# EAGLE design rc_switch_dualsided (EAGLE 6.5.0)
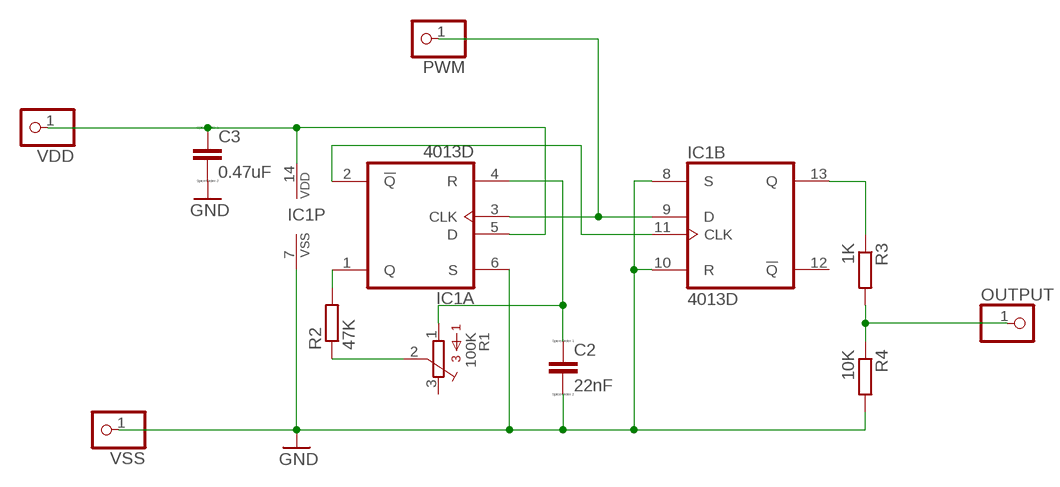
[diagram p0: schematic, sheet 1]

## Parts
C2  22nF  CC3216  [C3216]
C3  0.47uF  CC3216  [C3216]
IC1  4013D  [SO14]
OUTPUT  PINHD-1X1  [1X01]
PWM  PINHD-1X1  [1X01]
R1  100K  3386-P  [3386P]
R2  47K  R-EU_R3225  [R3225]
R3  1K  R-EU_R3225  [R3225]
R4  10K  R-EU_R3225  [R3225]
VDD  PINHD-1X1  [1X01]
VSS  PINHD-1X1  [1X01]

## Nets
GND: C2.2 C3.2 IC1.6(A:S) IC1.7(P:VSS) IC1.8(B:S) IC1.10(B:R) R4.2 VSS.1
N$1: IC1.1(A:Q) R2.2
N$2: R1.2 R2.1
N$3: C2.1 IC1.4(A:R) R1.1
N$4: IC1.13(B:Q) R3.1
N$6: IC1.3(A:CLK) IC1.9(B:D) PWM.1
N$8: IC1.2(A:!Q) IC1.11(B:CLK)
N$9: C3.1 IC1.5(A:D) IC1.14(P:VDD) VDD.1
OUTPUT: OUTPUT.1 R3.2 R4.1
Unconnected: IC1.12(B:!Q) R1.3

## Library data of the parts
C2 C3 = eagle-ltspice:C: CAPACITOR, European symbol; SPICEMODEL: NONE; SPICEPREFIX: C
IC1 = 40xx:4013: Dual D FLIP FLOP, set/reset
OUTPUT PWM VDD VSS = pinhead:PINHD-1X1: PIN HEADER
R1 = bourns:3386-: 3386 Series 3/8" Square Trimmer
R2-R4 = rcl:R-EU_: RESISTOR, European symbol

## Board
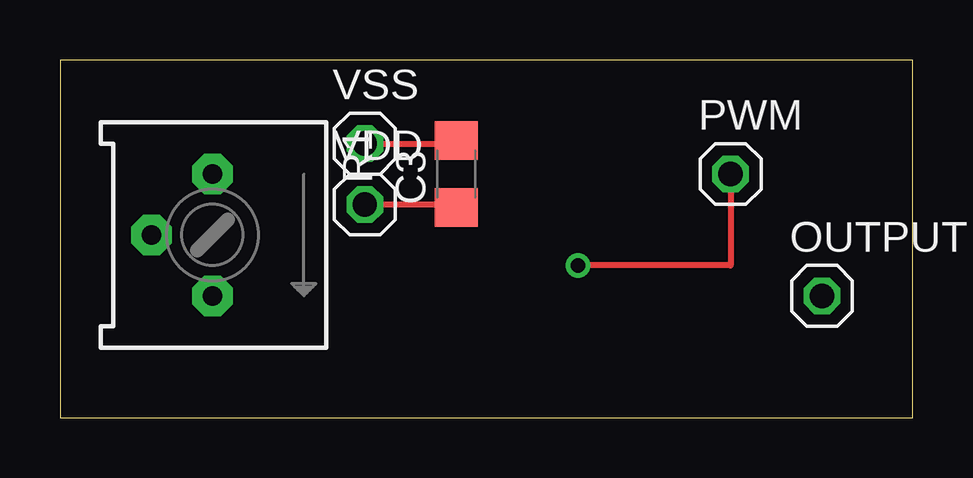
[diagram p1: board, top side]
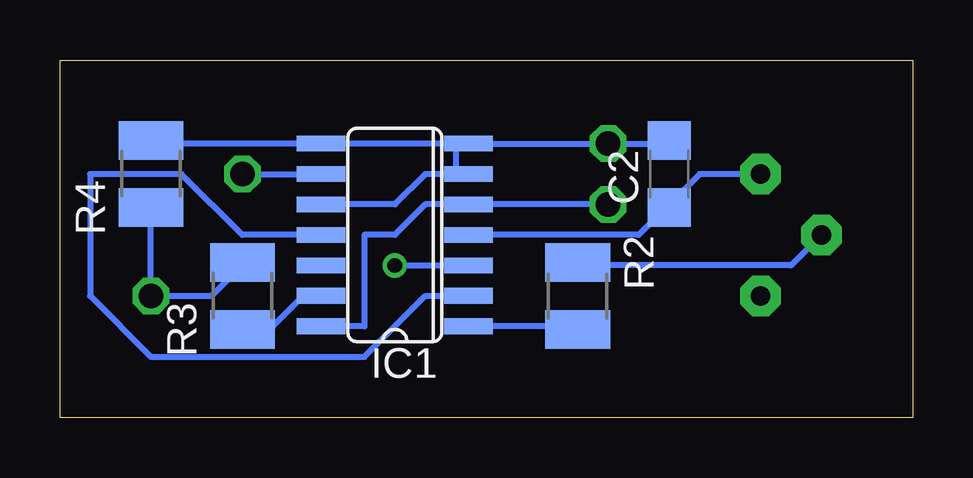
[diagram p2: board, bottom side, seen from below]

Size 35.54 x 14.91 mm. Coordinates in mm from the lower left corner, seen from the top.
Outline: 0,0 35.54,0 35.54,14.91 0,14.91 0,0
Copper layers (1*16): Top 0.035mm / dielectric 1.5mm / Bottom 0.035mm
Design rules "rcswitch": minimum track width 10mil, minimum drill 24mil, track to track 0.205mm, track to pad 0.205mm, pad to pad 0.205mm, via to via 0.205mm, smd to smd 8mil, copper to edge 40mil, drill to drill 8mil, minimum pad ring 10mil, minimum via ring 8mil, stop-mask expansion 4mil, vias tented up to drill 0mil, thermal gap 10mil

### Footprints (pad centres in the part's own frame; a part is rotated, then mirrored left to right if it is on the bottom)
C3216 = smd 1.6 x 1.8: 1 -1.4,0; 2 1.4,0
SO14 = smd 0.66 x 2.032: 1 -3.81,-3.073; 2 -2.54,-3.073; 3 -1.27,-3.073; 4 0,-3.073; 5 1.27,-3.073; 6 2.54,-3.073; 7 3.81,-3.073; 8 3.81,3.073; 9 2.54,3.073; 10 1.27,3.073; 11 0,3.073; 12 -1.27,3.073; 13 -2.54,3.073; 14 -3.81,3.073
1X01 = drill 1.016 octagon: 1 0,0
3386P = drill 0.813 pad 1.676 octagon: 1 -2.54,0; 2 0,-2.54; 3 2.54,0
R3225 = smd 1.6 x 2.7: 1 -1.4,0; 2 1.4,0

### Placement (x,y rotation side)
C2  10.16,10.16 90 bottom
C3  16.51,10.16 90 top
IC1  21.59,7.62 90 bottom
OUTPUT  31.75,5.08 0 top
PWM  27.94,10.16 0 top
R1  6.35,7.62 270 top
R2  13.97,5.08 270 bottom
R3  27.94,5.08 90 bottom
R4  31.75,10.16 90 bottom
VDD  12.7,8.89 0 top
VSS  12.7,11.43 0 top

### Tracks (layer width: path | path; a pad name or v marks a point on that pad's centre or on a via)
GND
  Top 0.254: VSS.1 16.51,11.43 C3.2
  Bottom 0.254: C2.2 10.16,11.43 VSS.1 IC1.7 19.05,11.43 | 19.05,11.43 19.05,10.16 | IC1.10 21.59,8.89 20.32,10.16 19.05,10.16 | 19.05,10.16 IC1.6 | 19.05,11.43 IC1.8 31.75,11.43 R4.2
N$1
  Bottom 0.254: IC1.1 13.97,3.81 R2.2
N$2
  Bottom 0.254: R1.2 5.08,6.35 13.97,6.35 R2.1
N$3
  Bottom 0.254: 10.16,8.89 8.89,10.16 R1.1 | IC1.4 11.43,7.62 10.16,8.89 | 10.16,8.89 C2.1
N$4
  Bottom 0.254: IC1.13 25.4,5.08 26.67,3.81 27.94,3.81 R3.1
N$6  (via drill 0.61)
  Top 0.254: v21.59,6.35 27.94,6.35 PWM.1
  Bottom 0.254: v21.59,6.35 IC1.3 | PWM.1 IC1.9
N$8
  Bottom 0.254: IC1.2 20.32,5.08 22.86,2.54 31.75,2.54 34.29,5.08 34.29,10.16 30.48,10.16 27.94,7.62 IC1.11
N$9
  Top 0.254: VDD.1 16.51,8.89 C3.1
  Bottom 0.254: VDD.1 IC1.5 20.32,8.89 21.59,7.62 22.86,7.62 22.86,3.81 IC1.14
OUTPUT
  Bottom 0.254: R3.2 27.94,6.35 29.21,5.08 OUTPUT.1 R4.1 31.75,8.89